# EasyEDA schematic 737NG MCDU_MainPanel_v.01.json
TITLE: 主面板; REV: 1.0; Date: 2023-03-26; Sheet: 1/1; Drawn By: Fish SWA; Company: 114514下北泽有限公司
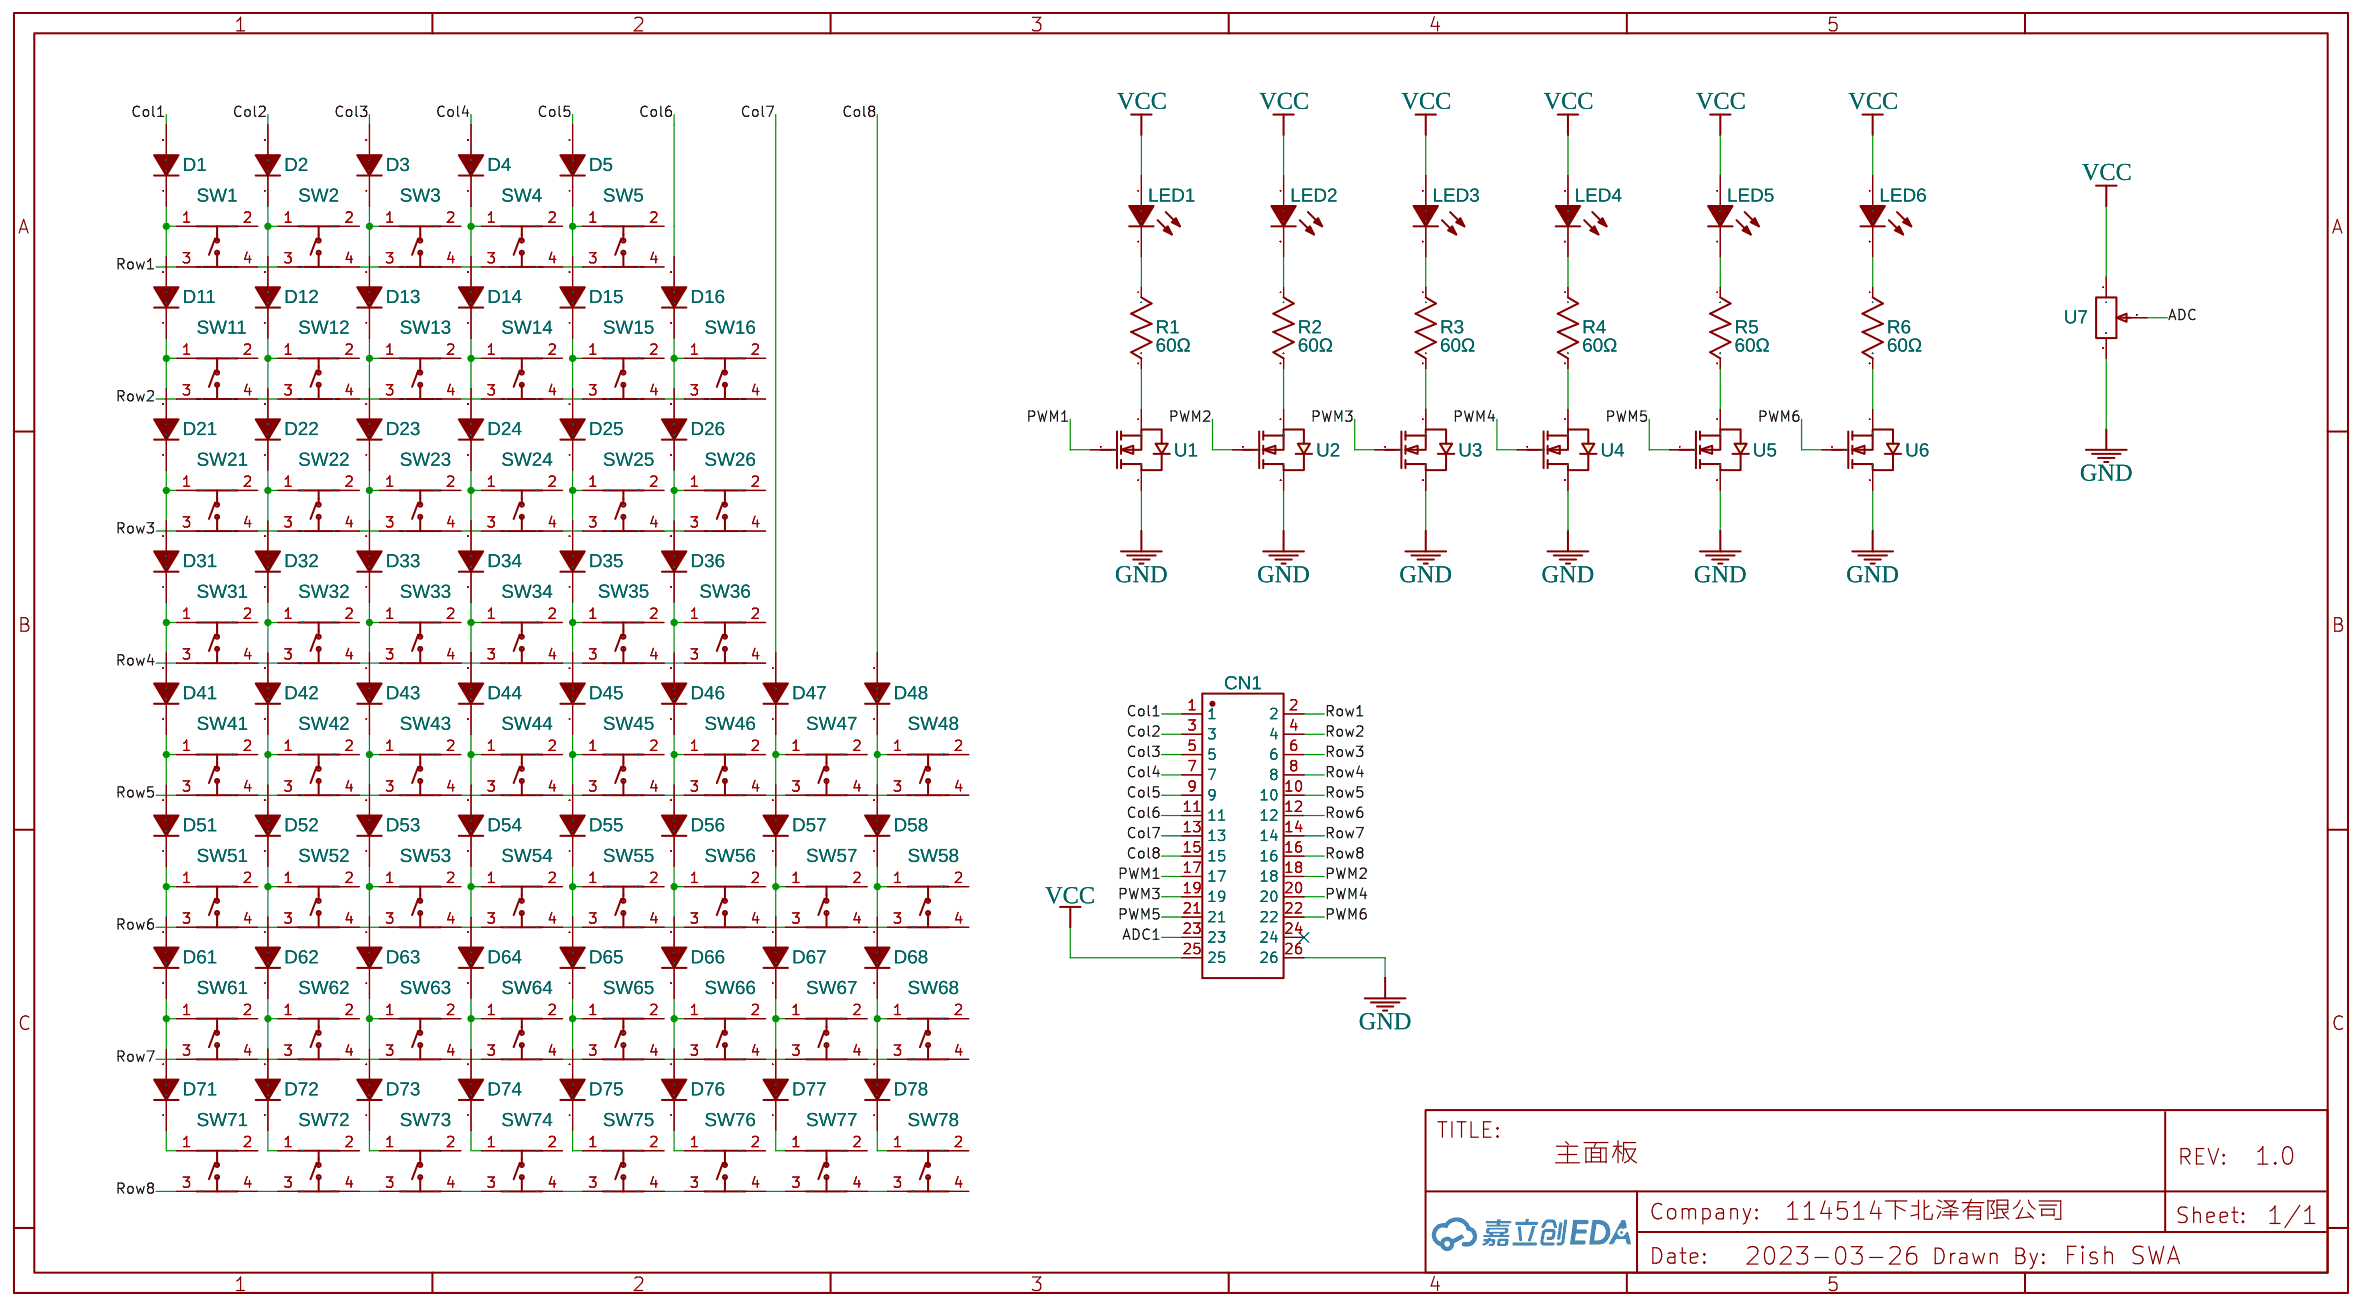
[diagram p0: schematic sheet]

## Parts
CN1  A2004WV-2X13P  [CONN-TH_26P-P2.00_A2004WV-2X13P]
D1  1N4148WS T4  [SOD-323_L1.8-W1.3-LS2.5-RD]
D2  1N4148WS T4  [SOD-323_L1.8-W1.3-LS2.5-RD]
D3  1N4148WS T4  [SOD-323_L1.8-W1.3-LS2.5-RD]
D4  1N4148WS T4  [SOD-323_L1.8-W1.3-LS2.5-RD]
D5  1N4148WS T4  [SOD-323_L1.8-W1.3-LS2.5-RD]
D11  1N4148WS T4  [SOD-323_L1.8-W1.3-LS2.5-RD]
D12  1N4148WS T4  [SOD-323_L1.8-W1.3-LS2.5-RD]
D13  1N4148WS T4  [SOD-323_L1.8-W1.3-LS2.5-RD]
D14  1N4148WS T4  [SOD-323_L1.8-W1.3-LS2.5-RD]
D15  1N4148WS T4  [SOD-323_L1.8-W1.3-LS2.5-RD]
D16  1N4148WS T4  [SOD-323_L1.8-W1.3-LS2.5-RD]
D21  1N4148WS T4  [SOD-323_L1.8-W1.3-LS2.5-RD]
D22  1N4148WS T4  [SOD-323_L1.8-W1.3-LS2.5-RD]
D23  1N4148WS T4  [SOD-323_L1.8-W1.3-LS2.5-RD]
D24  1N4148WS T4  [SOD-323_L1.8-W1.3-LS2.5-RD]
D25  1N4148WS T4  [SOD-323_L1.8-W1.3-LS2.5-RD]
D26  1N4148WS T4  [SOD-323_L1.8-W1.3-LS2.5-RD]
D31  1N4148WS T4  [SOD-323_L1.8-W1.3-LS2.5-RD]
D32  1N4148WS T4  [SOD-323_L1.8-W1.3-LS2.5-RD]
D33  1N4148WS T4  [SOD-323_L1.8-W1.3-LS2.5-RD]
D34  1N4148WS T4  [SOD-323_L1.8-W1.3-LS2.5-RD]
D35  1N4148WS T4  [SOD-323_L1.8-W1.3-LS2.5-RD]
D36  1N4148WS T4  [SOD-323_L1.8-W1.3-LS2.5-RD]
D41  1N4148WS T4  [SOD-323_L1.8-W1.3-LS2.5-RD]
D42  1N4148WS T4  [SOD-323_L1.8-W1.3-LS2.5-RD]
D43  1N4148WS T4  [SOD-323_L1.8-W1.3-LS2.5-RD]
D44  1N4148WS T4  [SOD-323_L1.8-W1.3-LS2.5-RD]
D45  1N4148WS T4  [SOD-323_L1.8-W1.3-LS2.5-RD]
D46  1N4148WS T4  [SOD-323_L1.8-W1.3-LS2.5-RD]
D47  1N4148WS T4  [SOD-323_L1.8-W1.3-LS2.5-RD]
D48  1N4148WS T4  [SOD-323_L1.8-W1.3-LS2.5-RD]
D51  1N4148WS T4  [SOD-323_L1.8-W1.3-LS2.5-RD]
D52  1N4148WS T4  [SOD-323_L1.8-W1.3-LS2.5-RD]
D53  1N4148WS T4  [SOD-323_L1.8-W1.3-LS2.5-RD]
D54  1N4148WS T4  [SOD-323_L1.8-W1.3-LS2.5-RD]
D55  1N4148WS T4  [SOD-323_L1.8-W1.3-LS2.5-RD]
D56  1N4148WS T4  [SOD-323_L1.8-W1.3-LS2.5-RD]
D57  1N4148WS T4  [SOD-323_L1.8-W1.3-LS2.5-RD]
D58  1N4148WS T4  [SOD-323_L1.8-W1.3-LS2.5-RD]
D61  1N4148WS T4  [SOD-323_L1.8-W1.3-LS2.5-RD]
D62  1N4148WS T4  [SOD-323_L1.8-W1.3-LS2.5-RD]
D63  1N4148WS T4  [SOD-323_L1.8-W1.3-LS2.5-RD]
D64  1N4148WS T4  [SOD-323_L1.8-W1.3-LS2.5-RD]
D65  1N4148WS T4  [SOD-323_L1.8-W1.3-LS2.5-RD]
D66  1N4148WS T4  [SOD-323_L1.8-W1.3-LS2.5-RD]
D67  1N4148WS T4  [SOD-323_L1.8-W1.3-LS2.5-RD]
D68  1N4148WS T4  [SOD-323_L1.8-W1.3-LS2.5-RD]
D71  1N4148WS T4  [SOD-323_L1.8-W1.3-LS2.5-RD]
D72  1N4148WS T4  [SOD-323_L1.8-W1.3-LS2.5-RD]
D73  1N4148WS T4  [SOD-323_L1.8-W1.3-LS2.5-RD]
D74  1N4148WS T4  [SOD-323_L1.8-W1.3-LS2.5-RD]
D75  1N4148WS T4  [SOD-323_L1.8-W1.3-LS2.5-RD]
D76  1N4148WS T4  [SOD-323_L1.8-W1.3-LS2.5-RD]
D77  1N4148WS T4  [SOD-323_L1.8-W1.3-LS2.5-RD]
D78  1N4148WS T4  [SOD-323_L1.8-W1.3-LS2.5-RD]
LED1  SML-H12P8TT86  [LED0805-R-RD_GREEN]
LED2  SML-H12P8TT86  [LED0805-R-RD_GREEN]
LED3  SML-H12P8TT86  [LED0805-R-RD_GREEN]
LED4  SML-H12P8TT86  [LED0805-R-RD_GREEN]
LED5  SML-H12P8TT86  [LED0805-R-RD_GREEN]
LED6  SML-H12P8TT86  [LED0805-R-RD_GREEN]
R1  60Ω  [R0805]
R2  60Ω  [R0805]
R3  60Ω  [R0805]
R4  60Ω  [R0805]
R5  60Ω  [R0805]
R6  60Ω  [R0805]
SW1  PTS525SM15SMTR2LFS  [KEY-SMD_4P-L5.2-W5.2-P3.80-LS6.2]
SW2  PTS525SM15SMTR2LFS  [KEY-SMD_4P-L5.2-W5.2-P3.80-LS6.2]
SW3  PTS525SM15SMTR2LFS  [KEY-SMD_4P-L5.2-W5.2-P3.80-LS6.2]
SW4  PTS525SM15SMTR2LFS  [KEY-SMD_4P-L5.2-W5.2-P3.80-LS6.2]
SW5  PTS525SM15SMTR2LFS  [KEY-SMD_4P-L5.2-W5.2-P3.80-LS6.2]
SW11  PTS525SM15SMTR2LFS  [KEY-SMD_4P-L5.2-W5.2-P3.80-LS6.2]
SW12  PTS525SM15SMTR2LFS  [KEY-SMD_4P-L5.2-W5.2-P3.80-LS6.2]
SW13  PTS525SM15SMTR2LFS  [KEY-SMD_4P-L5.2-W5.2-P3.80-LS6.2]
SW14  PTS525SM15SMTR2LFS  [KEY-SMD_4P-L5.2-W5.2-P3.80-LS6.2]
SW15  PTS525SM15SMTR2LFS  [KEY-SMD_4P-L5.2-W5.2-P3.80-LS6.2]
SW16  PTS525SM15SMTR2LFS  [KEY-SMD_4P-L5.2-W5.2-P3.80-LS6.2]
SW21  PTS525SM15SMTR2LFS  [KEY-SMD_4P-L5.2-W5.2-P3.80-LS6.2]
SW22  PTS525SM15SMTR2LFS  [KEY-SMD_4P-L5.2-W5.2-P3.80-LS6.2]
SW23  PTS525SM15SMTR2LFS  [KEY-SMD_4P-L5.2-W5.2-P3.80-LS6.2]
SW24  PTS525SM15SMTR2LFS  [KEY-SMD_4P-L5.2-W5.2-P3.80-LS6.2]
SW25  PTS525SM15SMTR2LFS  [KEY-SMD_4P-L5.2-W5.2-P3.80-LS6.2]
SW26  PTS525SM15SMTR2LFS  [KEY-SMD_4P-L5.2-W5.2-P3.80-LS6.2]
SW31  PTS525SM15SMTR2LFS  [KEY-SMD_4P-L5.2-W5.2-P3.80-LS6.2]
SW32  PTS525SM15SMTR2LFS  [KEY-SMD_4P-L5.2-W5.2-P3.80-LS6.2]
SW33  PTS525SM15SMTR2LFS  [KEY-SMD_4P-L5.2-W5.2-P3.80-LS6.2]
SW34  PTS525SM15SMTR2LFS  [KEY-SMD_4P-L5.2-W5.2-P3.80-LS6.2]
SW35  PTS525SM15SMTR2LFS  [KEY-SMD_4P-L5.2-W5.2-P3.80-LS6.2]
SW36  PTS525SM15SMTR2LFS  [KEY-SMD_4P-L5.2-W5.2-P3.80-LS6.2]
SW41  PTS525SM15SMTR2LFS  [KEY-SMD_4P-L5.2-W5.2-P3.80-LS6.2]
SW42  PTS525SM15SMTR2LFS  [KEY-SMD_4P-L5.2-W5.2-P3.80-LS6.2]
SW43  PTS525SM15SMTR2LFS  [KEY-SMD_4P-L5.2-W5.2-P3.80-LS6.2]
SW44  PTS525SM15SMTR2LFS  [KEY-SMD_4P-L5.2-W5.2-P3.80-LS6.2]
SW45  PTS525SM15SMTR2LFS  [KEY-SMD_4P-L5.2-W5.2-P3.80-LS6.2]
SW46  PTS525SM15SMTR2LFS  [KEY-SMD_4P-L5.2-W5.2-P3.80-LS6.2]
SW47  PTS525SM15SMTR2LFS  [KEY-SMD_4P-L5.2-W5.2-P3.80-LS6.2]
SW48  PTS525SM15SMTR2LFS  [KEY-SMD_4P-L5.2-W5.2-P3.80-LS6.2]
SW51  PTS525SM15SMTR2LFS  [KEY-SMD_4P-L5.2-W5.2-P3.80-LS6.2]
SW52  PTS525SM15SMTR2LFS  [KEY-SMD_4P-L5.2-W5.2-P3.80-LS6.2]
SW53  PTS525SM15SMTR2LFS  [KEY-SMD_4P-L5.2-W5.2-P3.80-LS6.2]
SW54  PTS525SM15SMTR2LFS  [KEY-SMD_4P-L5.2-W5.2-P3.80-LS6.2]
SW55  PTS525SM15SMTR2LFS  [KEY-SMD_4P-L5.2-W5.2-P3.80-LS6.2]
SW56  PTS525SM15SMTR2LFS  [KEY-SMD_4P-L5.2-W5.2-P3.80-LS6.2]
SW57  PTS525SM15SMTR2LFS  [KEY-SMD_4P-L5.2-W5.2-P3.80-LS6.2]
SW58  PTS525SM15SMTR2LFS  [KEY-SMD_4P-L5.2-W5.2-P3.80-LS6.2]
SW61  PTS525SM15SMTR2LFS  [KEY-SMD_4P-L5.2-W5.2-P3.80-LS6.2]
SW62  PTS525SM15SMTR2LFS  [KEY-SMD_4P-L5.2-W5.2-P3.80-LS6.2]
SW63  PTS525SM15SMTR2LFS  [KEY-SMD_4P-L5.2-W5.2-P3.80-LS6.2]
SW64  PTS525SM15SMTR2LFS  [KEY-SMD_4P-L5.2-W5.2-P3.80-LS6.2]
SW65  PTS525SM15SMTR2LFS  [KEY-SMD_4P-L5.2-W5.2-P3.80-LS6.2]
SW66  PTS525SM15SMTR2LFS  [KEY-SMD_4P-L5.2-W5.2-P3.80-LS6.2]
SW67  PTS525SM15SMTR2LFS  [KEY-SMD_4P-L5.2-W5.2-P3.80-LS6.2]
SW68  PTS525SM15SMTR2LFS  [KEY-SMD_4P-L5.2-W5.2-P3.80-LS6.2]
SW71  PTS525SM15SMTR2LFS  [KEY-SMD_4P-L5.2-W5.2-P3.80-LS6.2]
SW72  PTS525SM15SMTR2LFS  [KEY-SMD_4P-L5.2-W5.2-P3.80-LS6.2]
SW73  PTS525SM15SMTR2LFS  [KEY-SMD_4P-L5.2-W5.2-P3.80-LS6.2]
SW74  PTS525SM15SMTR2LFS  [KEY-SMD_4P-L5.2-W5.2-P3.80-LS6.2]
SW75  PTS525SM15SMTR2LFS  [KEY-SMD_4P-L5.2-W5.2-P3.80-LS6.2]
SW76  PTS525SM15SMTR2LFS  [KEY-SMD_4P-L5.2-W5.2-P3.80-LS6.2]
SW77  PTS525SM15SMTR2LFS  [KEY-SMD_4P-L5.2-W5.2-P3.80-LS6.2]
SW78  PTS525SM15SMTR2LFS  [KEY-SMD_4P-L5.2-W5.2-P3.80-LS6.2]
U1  5N10_C5140036  [SOT-23-3_L2.9-W1.3-P1.90-LS2.4-BL-1]
U2  5N10_C5140036  [SOT-23-3_L2.9-W1.3-P1.90-LS2.4-BL-1]
U3  5N10_C5140036  [SOT-23-3_L2.9-W1.3-P1.90-LS2.4-BL-1]
U4  5N10_C5140036  [SOT-23-3_L2.9-W1.3-P1.90-LS2.4-BL-1]
U5  5N10_C5140036  [SOT-23-3_L2.9-W1.3-P1.90-LS2.4-BL-1]
U6  5N10_C5140036  [SOT-23-3_L2.9-W1.3-P1.90-LS2.4-BL-1]
U7  WH06-2C-203(20K)  [RES-ADJ-TH_VZ067TL1B202]

## Library data of the parts
CN1 = A2004WV-2X13P: Supplier: LCSC; Supplier Part: C465323; Manufacturer: HR(灿达); Contributor: LCSC; JLCPCB Part Class: Extended Part
D1-D5 D11-D16 D21-D26 D31-D36 D41-D48 D51-D58 D61-D68 D71-D78 = 1N4148WS T4: Supplier: LCSC; Manufacturer: CJ(江苏长电/长晶); Manufacturer Part: 1N4148WS; Supplier Part: C2128; JLCPCB Part Class: Basic Part
LED1-LED6 = SML-H12P8TT86: Supplier: LCSC; Supplier Part: C510035; Manufacturer: ROHM(罗姆); JLCPCB Part Class: Extended Part; Contributor: lcsc
R1-R6 = R_0805_US: Contributor: LCEDA_Lib
SW1-SW5 SW11-SW16 SW21-SW26 SW31-SW36 SW41-SW48 SW51-SW58 SW61-SW68 SW71-SW78 = PTS525SM15SMTR2LFS: Supplier: LCSC; Supplier Part: C221856; Manufacturer: C&K; Contributor: LCSC; JLCPCB Part Class: Extended Part
U1-U6 = 5N10_C5140036: Supplier: LCSC; Supplier Part: C5140036; Manufacturer: MSKSEMI(美森科); Manufacturer Part: 5N10-MS; link: https://atta.szlcsc.com/upload/public/pdf/source/20220822/06BF2936C98EB5EF479A75AC40D6F835.pdf; Contributor: lcsc; JLCPCB Part Class: Extended Part
U7 = WH06-2C-203(20K): Supplier: LCSC; Supplier Part: C5205044; Manufacturer: BOCHEN(博晨); link: https://atta.szlcsc.com/upload/public/pdf/source/20221019/683A1EE763180882FA5E0C1228474CEE.pdf; Contributor: lcsc

## Nets
GND: CN1.26 U1.3(D) U2.3(D) U3.3(D) U4.3(D) U5.3(D) U6.3(D) U7.3
VCC: CN1.25 LED1.1(A) LED2.1(A) LED3.1(A) LED4.1(A) LED5.1(A) LED6.1(A) U7.1
ADC: U7.2
ADC1: CN1.23
Col1: CN1.1 D1.2(A)
Col2: CN1.3 D2.2(A)
Col3: CN1.5 D3.2(A)
Col4: CN1.7 D4.2(A)
Col5: CN1.9 D5.2(A)
Col6: CN1.11 D16.2(A)
Col7: CN1.13 D47.2(A)
Col8: CN1.15 D48.2(A)
PWM1: CN1.17 U1.1(G)
PWM2: CN1.18 U2.1(G)
PWM3: CN1.19 U3.1(G)
PWM4: CN1.20 U4.1(G)
PWM5: CN1.21 U5.1(G)
PWM6: CN1.22 U6.1(G)
Row1: CN1.2 SW1.3
Row2: CN1.4 SW11.3
Row3: CN1.6 SW21.3
Row4: CN1.8 SW31.3
Row5: CN1.10 SW41.3
Row6: CN1.12 SW51.3
Row7: CN1.14 SW61.3
Row8: CN1.16 SW71.3
Net-(D1-1): D1.1(K) D11.2(A) SW1.1
Net-(D2-1): D2.1(K) D12.2(A) SW2.1
Net-(D3-1): D3.1(K) D13.2(A) SW3.1
Net-(D4-1): D4.1(K) D14.2(A) SW4.1
Net-(D5-1): D5.1(K) D15.2(A) SW5.1
Net-(D11-1): D11.1(K) D21.2(A) SW11.1
Net-(D12-1): D12.1(K) D22.2(A) SW12.1
Net-(D13-1): D13.1(K) D23.2(A) SW13.1
Net-(D14-1): D14.1(K) D24.2(A) SW14.1
Net-(D15-1): D15.1(K) D25.2(A) SW15.1
Net-(D16-1): D16.1(K) D26.2(A) SW16.1
Net-(D21-1): D21.1(K) D31.2(A) SW21.1
Net-(D22-1): D22.1(K) D32.2(A) SW22.1
Net-(D23-1): D23.1(K) D33.2(A) SW23.1
Net-(D24-1): D24.1(K) D34.2(A) SW24.1
Net-(D25-1): D25.1(K) D35.2(A) SW25.1
Net-(D26-1): D26.1(K) D36.2(A) SW26.1
Net-(D31-1): D31.1(K) D41.2(A) SW31.1
Net-(D32-1): D32.1(K) D42.2(A) SW32.1
Net-(D33-1): D33.1(K) D43.2(A) SW33.1
Net-(D34-1): D34.1(K) D44.2(A) SW34.1
Net-(D35-1): D35.1(K) D45.2(A) SW35.1
Net-(D36-1): D36.1(K) D46.2(A) SW36.1
Net-(D41-1): D41.1(K) D51.2(A) SW41.1
Net-(D42-1): D42.1(K) D52.2(A) SW42.1
Net-(D43-1): D43.1(K) D53.2(A) SW43.1
Net-(D44-1): D44.1(K) D54.2(A) SW44.1
Net-(D45-1): D45.1(K) D55.2(A) SW45.1
Net-(D46-1): D46.1(K) D56.2(A) SW46.1
Net-(D47-1): D47.1(K) D57.2(A) SW47.1
Net-(D48-1): D48.1(K) D58.2(A) SW48.1
Net-(D51-1): D51.1(K) D61.2(A) SW51.1
Net-(D52-1): D52.1(K) D62.2(A) SW52.1
Net-(D53-1): D53.1(K) D63.2(A) SW53.1
Net-(D54-1): D54.1(K) D64.2(A) SW54.1
Net-(D55-1): D55.1(K) D65.2(A) SW55.1
Net-(D56-1): D56.1(K) D66.2(A) SW56.1
Net-(D57-1): D57.1(K) D67.2(A) SW57.1
Net-(D58-1): D58.1(K) D68.2(A) SW58.1
Net-(D61-1): D61.1(K) D71.2(A) SW61.1
Net-(D62-1): D62.1(K) D72.2(A) SW62.1
Net-(D63-1): D63.1(K) D73.2(A) SW63.1
Net-(D64-1): D64.1(K) D74.2(A) SW64.1
Net-(D65-1): D65.1(K) D75.2(A) SW65.1
Net-(D66-1): D66.1(K) D76.2(A) SW66.1
Net-(D67-1): D67.1(K) D77.2(A) SW67.1
Net-(D68-1): D68.1(K) D78.2(A) SW68.1
Net-(D71-1): D71.1(K) SW71.1
Net-(D72-1): D72.1(K) SW72.1
Net-(D73-1): D73.1(K) SW73.1
Net-(D74-1): D74.1(K) SW74.1
Net-(D75-1): D75.1(K) SW75.1
Net-(D76-1): D76.1(K) SW76.1
Net-(D77-1): D77.1(K) SW77.1
Net-(D78-1): D78.1(K) SW78.1
Net-(LED1-2): LED1.2(C) R1.1
Net-(LED2-2): LED2.2(C) R2.1
Net-(LED3-2): LED3.2(C) R3.1
Net-(LED4-2): LED4.2(C) R4.1
Net-(LED5-2): LED5.2(C) R5.1
Net-(LED6-2): LED6.2(C) R6.1
Net-(R1-2): R1.2 U1.2(S)
Net-(R2-2): R2.2 U2.2(S)
Net-(R3-2): R3.2 U3.2(S)
Net-(R4-2): R4.2 U4.2(S)
Net-(R5-2): R5.2 U5.2(S)
Net-(R6-2): R6.2 U6.2(S)
Net-(SW1-4): SW1.4 SW2.3
Net-(SW2-4): SW2.4 SW3.3
Net-(SW3-4): SW3.4 SW4.3
Net-(SW4-4): SW4.4 SW5.3
Net-(SW11-4): SW11.4 SW12.3
Net-(SW12-4): SW12.4 SW13.3
Net-(SW13-4): SW13.4 SW14.3
Net-(SW14-4): SW14.4 SW15.3
Net-(SW15-4): SW15.4 SW16.3
Net-(SW21-4): SW21.4 SW22.3
Net-(SW22-4): SW22.4 SW23.3
Net-(SW23-4): SW23.4 SW24.3
Net-(SW24-4): SW24.4 SW25.3
Net-(SW25-4): SW25.4 SW26.3
Net-(SW31-4): SW31.4 SW32.3
Net-(SW32-4): SW32.4 SW33.3
Net-(SW33-4): SW33.4 SW34.3
Net-(SW34-4): SW34.4 SW35.3
Net-(SW35-4): SW35.4 SW36.3
Net-(SW41-4): SW41.4 SW42.3
Net-(SW42-4): SW42.4 SW43.3
Net-(SW43-4): SW43.4 SW44.3
Net-(SW44-4): SW44.4 SW45.3
Net-(SW45-4): SW45.4 SW46.3
Net-(SW46-4): SW46.4 SW47.3
Net-(SW47-4): SW47.4 SW48.3
Net-(SW51-4): SW51.4 SW52.3
Net-(SW52-4): SW52.4 SW53.3
Net-(SW53-4): SW53.4 SW54.3
Net-(SW54-4): SW54.4 SW55.3
Net-(SW55-4): SW55.4 SW56.3
Net-(SW56-4): SW56.4 SW57.3
Net-(SW57-4): SW57.4 SW58.3
Net-(SW61-4): SW61.4 SW62.3
Net-(SW62-4): SW62.4 SW63.3
Net-(SW63-4): SW63.4 SW64.3
Net-(SW64-4): SW64.4 SW65.3
Net-(SW65-4): SW65.4 SW66.3
Net-(SW66-4): SW66.4 SW67.3
Net-(SW67-4): SW67.4 SW68.3
Net-(SW71-4): SW71.4 SW72.3
Net-(SW72-4): SW72.4 SW73.3
Net-(SW73-4): SW73.4 SW74.3
Net-(SW74-4): SW74.4 SW75.3
Net-(SW75-4): SW75.4 SW76.3
Net-(SW76-4): SW76.4 SW77.3
Net-(SW77-4): SW77.4 SW78.3

Not connected (* = marked no-connect by the designer): CN1 24*; SW1 2; SW2 2; SW3 2; SW4 2; SW5 2 4; SW11 2; SW12 2; SW13 2; SW14 2; SW15 2; SW16 2 4; SW21 2; SW22 2; SW23 2; SW24 2; SW25 2; SW26 2 4; SW31 2; SW32 2; SW33 2; SW34 2; SW35 2; SW36 2 4; SW41 2; SW42 2; SW43 2; SW44 2; SW45 2; SW46 2; SW47 2; SW48 2 4; SW51 2; SW52 2; SW53 2; SW54 2; SW55 2; SW56 2; SW57 2; SW58 2 4; SW61 2; SW62 2; SW63 2; SW64 2; SW65 2; SW66 2; SW67 2; SW68 2 4; SW71 2; SW72 2; SW73 2; SW74 2; SW75 2; SW76 2; SW77 2; SW78 2 4
